# EAGLE design relay (EAGLE 9.6.2)
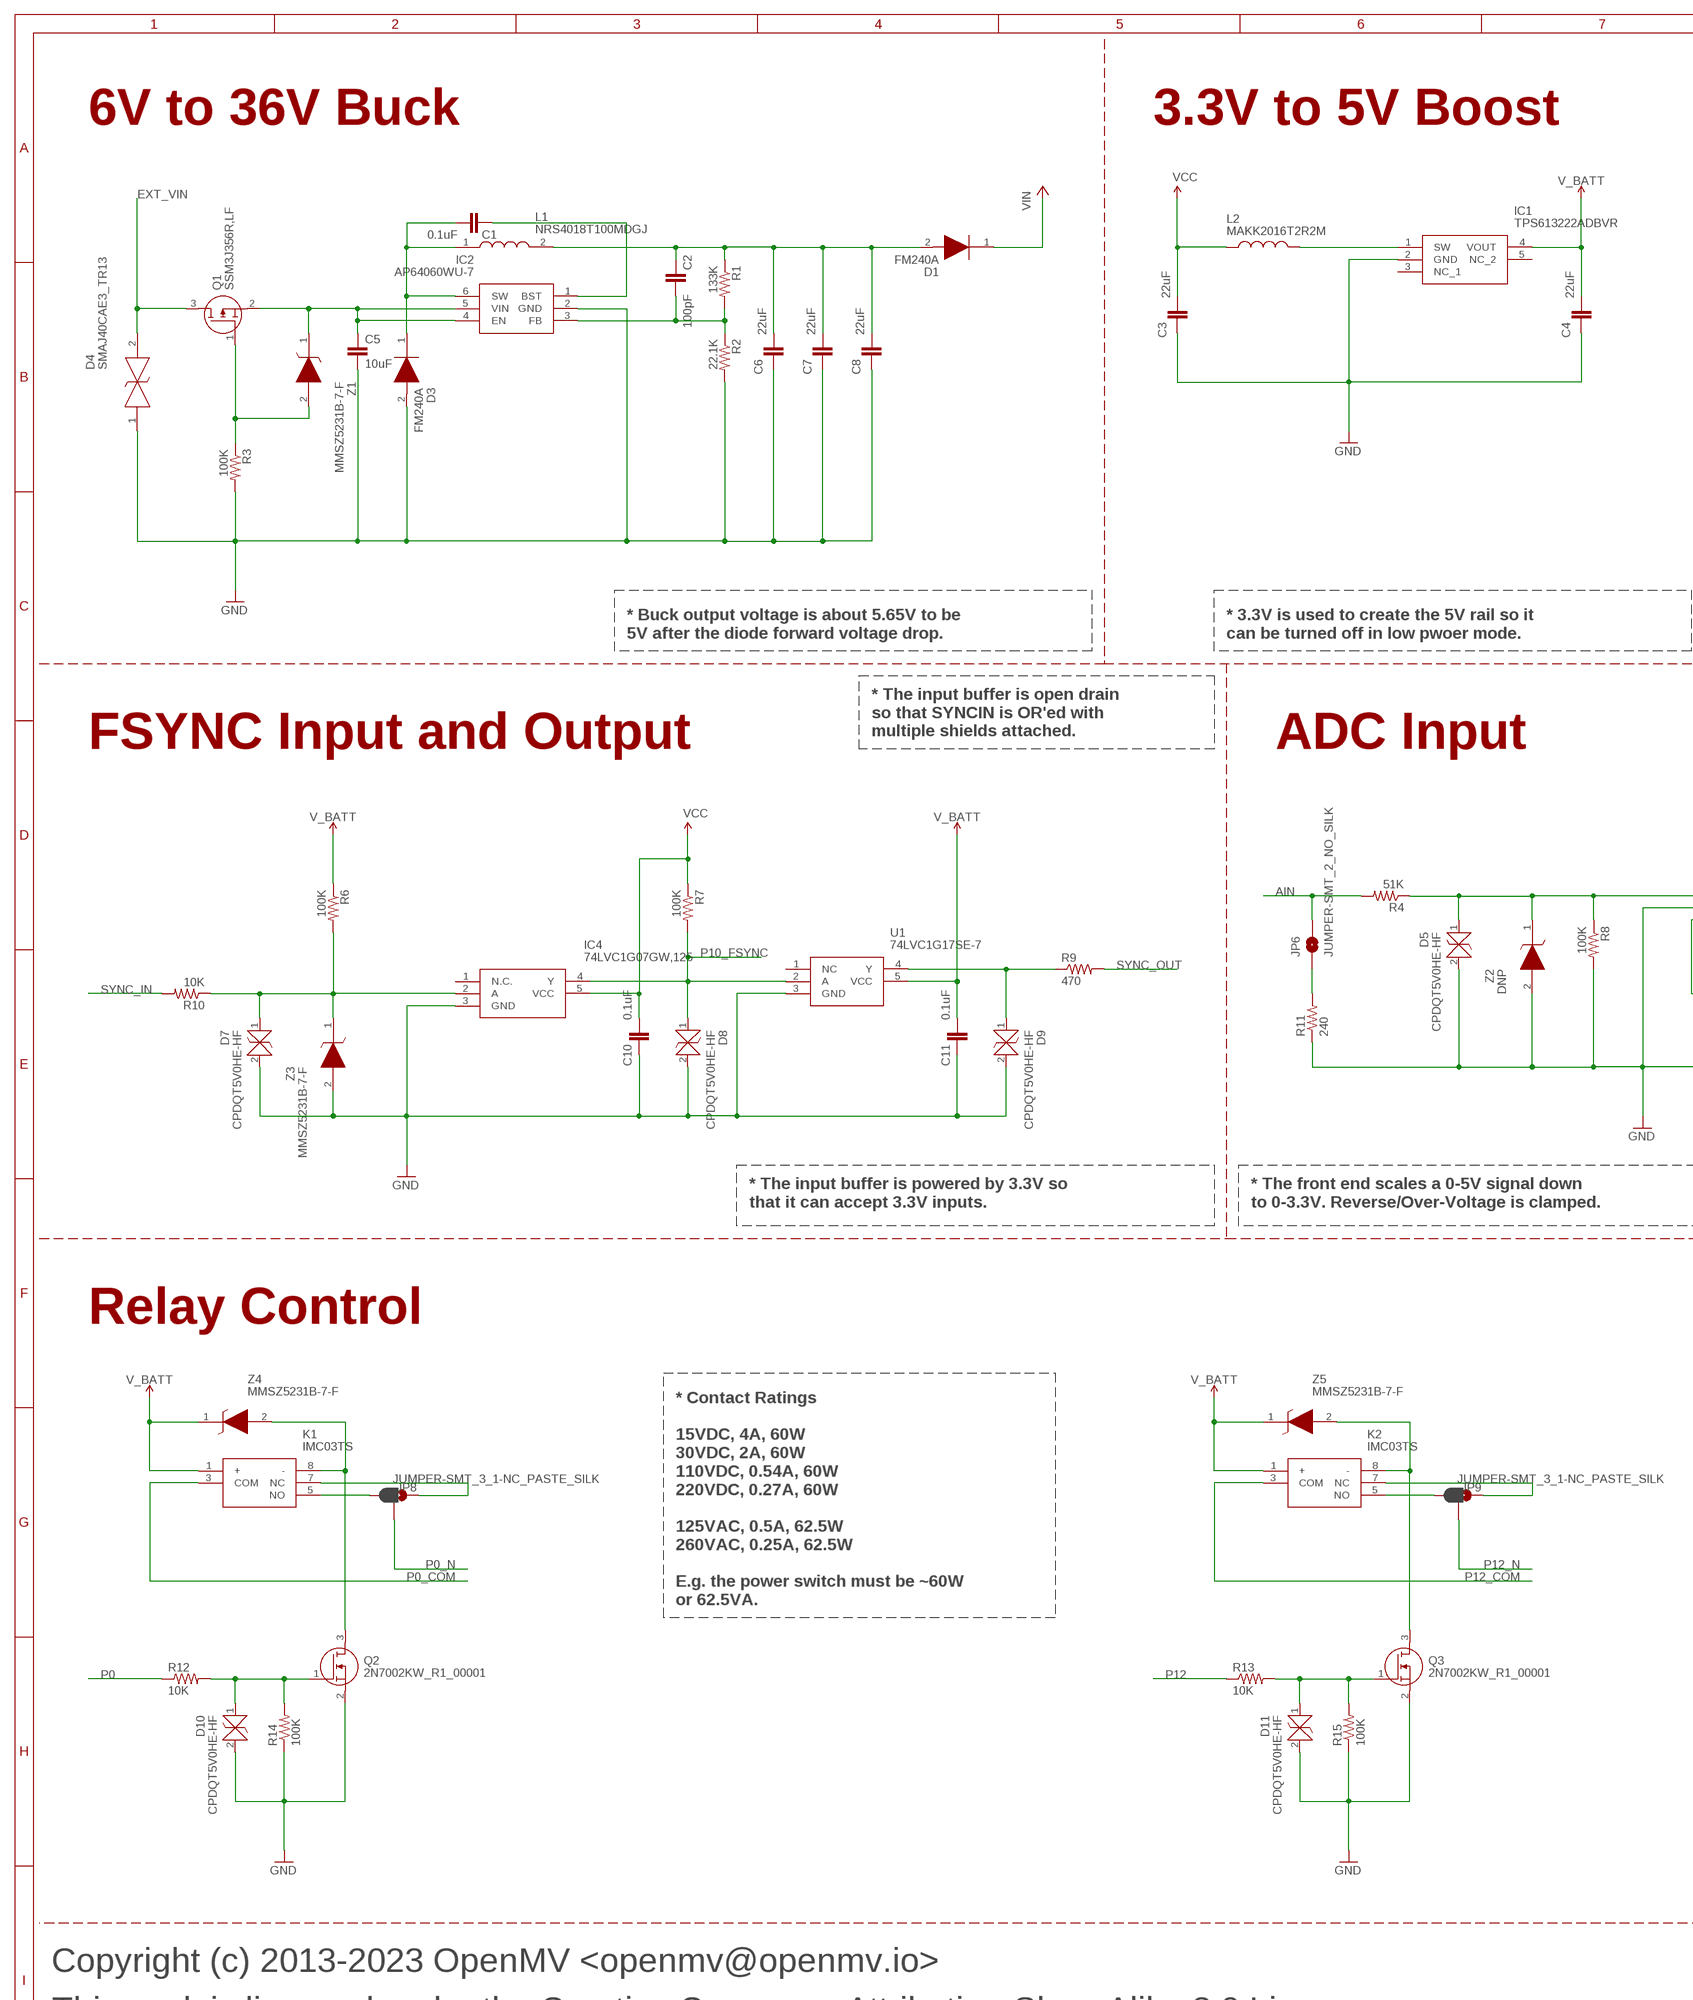
[diagram p0: schematic, sheet 1, part 1 of 2]
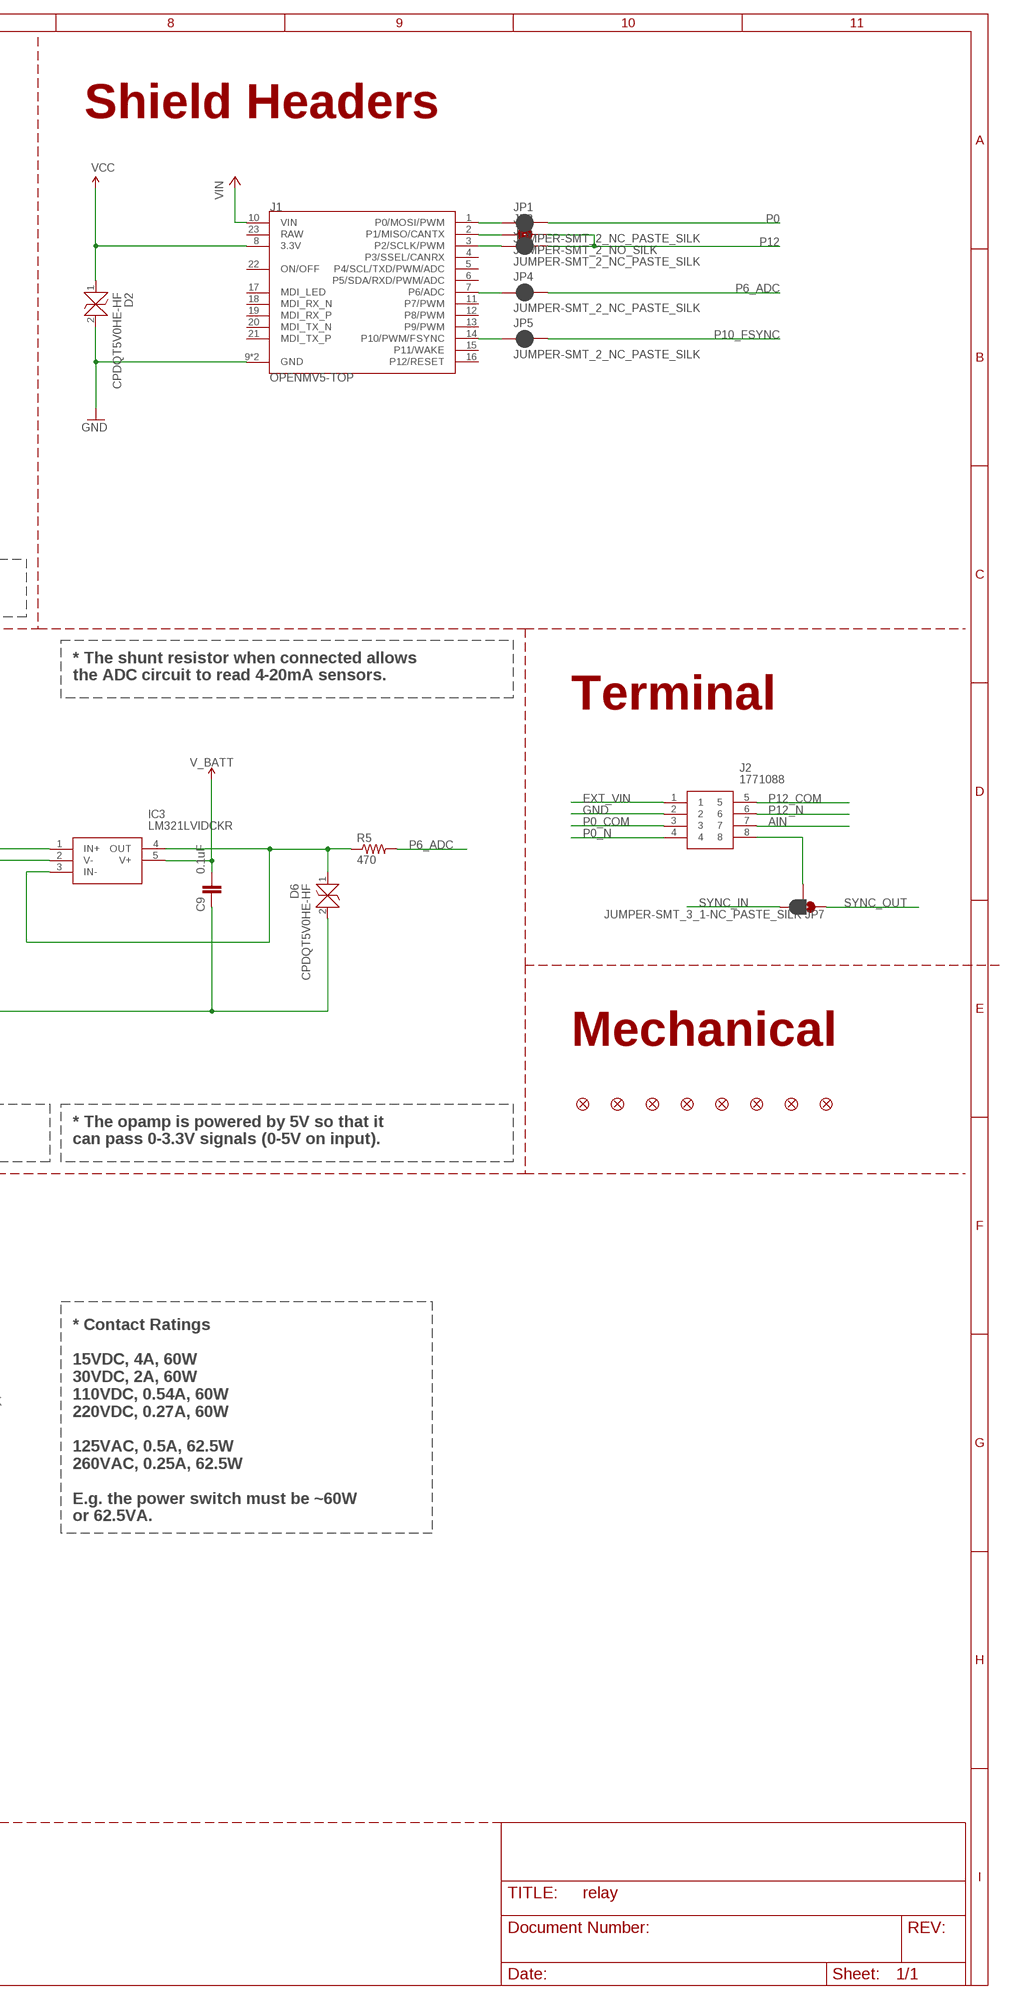
[diagram p1: schematic, sheet 1, part 2 of 2]

## Parts
C1  0.1uF  CAP0402-CAP  [0402-CAP]
C2  100pF  CAP0402-CAP  [0402-CAP]
C3  22uF  22UF-0805-6.3V-20%  [0805]
C4  22uF  22UF-0805-6.3V-20%  [0805]
C5  10uF  C-EUC0805  [C0805]
C6  22uF  22UF-0805-6.3V-20%  [0805]
C7  22uF  22UF-0805-6.3V-20%  [0805]
C8  22uF  22UF-0805-6.3V-20%  [0805]
C9  0.1uF  CAP0402-CAP  [0402-CAP]
C10  0.1uF  CAP0402-CAP  [0402-CAP]
C11  0.1uF  CAP0402-CAP  [0402-CAP]
D1  FM240A  [DIOM5025X231N]
D2  CPDQT5V0HE-HF  [CPDQT5V0HEHF]
D3  FM240A  [DIOM5025X231N]
D4  SMAJ40CAE3_TR13  [SMAJ40CAE3TR13]
D5  CPDQT5V0HE-HF  [CPDQT5V0HEHF]
D6  CPDQT5V0HE-HF  [CPDQT5V0HEHF]
D7  CPDQT5V0HE-HF  [CPDQT5V0HEHF]
D8  CPDQT5V0HE-HF  [CPDQT5V0HEHF]
D9  CPDQT5V0HE-HF  [CPDQT5V0HEHF]
D10  CPDQT5V0HE-HF  [CPDQT5V0HEHF]
D11  CPDQT5V0HE-HF  [CPDQT5V0HEHF]
FD1  FIDUCIAL1X2  [FIDUCIAL-1X2]
FD2  FIDUCIAL1X2  [FIDUCIAL-1X2]
FD3  FIDUCIAL1X2  [FIDUCIAL-1X2]
FD4  FIDUCIAL1X2  [FIDUCIAL-1X2]
FD5  FIDUCIAL1X2  [FIDUCIAL-1X2]
FD6  FIDUCIAL1X2  [FIDUCIAL-1X2]
FD7  FIDUCIAL1X2  [FIDUCIAL-1X2]
FD8  FIDUCIAL1X2  [FIDUCIAL-1X2]
IC1  TPS613222ADBVR  [SOT95P280X145-5N]
IC2  AP64060WU-7  [SOT95P280X100-6N]
IC3  LM321LVIDCKR  [SOT65P210X110-5N]
IC4  74LVC1G07GW,125  [SOT65P212X110-5N]
J1  OPENMV5-TOP  [OPENMV5-TOP]
J2  1771088  [1771088]
JP1  JUMPER-SMT_2_NC_PASTE_SILK  [SMT-JUMPER_2_NC_PASTE_SILK]
JP2  JUMPER-SMT_2_NO_SILK  [SMT-JUMPER_2_NO_SILK]
JP3  JUMPER-SMT_2_NC_PASTE_SILK  [SMT-JUMPER_2_NC_PASTE_SILK]
JP4  JUMPER-SMT_2_NC_PASTE_SILK  [SMT-JUMPER_2_NC_PASTE_SILK]
JP5  JUMPER-SMT_2_NC_PASTE_SILK  [SMT-JUMPER_2_NC_PASTE_SILK]
JP6  JUMPER-SMT_2_NO_SILK  [SMT-JUMPER_2_NO_SILK]
JP7  JUMPER-SMT_3_1-NC_PASTE_SILK  [SMT-JUMPER_3_1-NC_PASTE_SILK]
JP8  JUMPER-SMT_3_1-NC_PASTE_SILK  [SMT-JUMPER_3_1-NC_PASTE_SILK]
JP9  JUMPER-SMT_3_1-NC_PASTE_SILK  [SMT-JUMPER_3_1-NC_PASTE_SILK]
K1  IMC03TS  [IMC03TS]
K2  IMC03TS  [IMC03TS]
L1  NRS4018T100MDGJ  [NRS4018T100MDGJ]
L2  MAKK2016T2R2M  [INDC2016X100N]
Q1  SSM3J356R,LF  [SOTFL95P240X88-3N]
Q2  2N7002KW_R1_00001  [SOT65P210X110-3N]
Q3  2N7002KW_R1_00001  [SOT65P210X110-3N]
R1  133K  RESISTOR0402-RES  [0402-RES]
R2  22.1K  RESISTOR0402-RES  [0402-RES]
R3  100K  RESISTOR0402-RES  [0402-RES]
R4  51K  RESISTOR0402-RES  [0402-RES]
R5  470  R-US_R0603  [R0603]
R6  100K  RESISTOR0402-RES  [0402-RES]
R7  100K  RESISTOR0402-RES  [0402-RES]
R8  100K  RESISTOR0402-RES  [0402-RES]
R9  470  R-US_R0603  [R0603]
R10  10K  RESISTOR0402-RES  [0402-RES]
R11  240  R-US_R0603  [R0603]
R12  10K  RESISTOR0402-RES  [0402-RES]
R13  10K  RESISTOR0402-RES  [0402-RES]
R14  100K  RESISTOR0402-RES  [0402-RES]
R15  100K  RESISTOR0402-RES  [0402-RES]
U1  74LVC1G17SE-7  [SOT65P210X110-5N]
Z1  MMSZ5231B-7-F  [SOD3716X145N]
Z2  DNP  MM3Z3V6T1G  [SOD2512X110N]
Z3  MMSZ5231B-7-F  [SOD3716X145N]
Z4  MMSZ5231B-7-F  [SOD3716X145N]
Z5  MMSZ5231B-7-F  [SOD3716X145N]

## Nets
AIN [signal]: J2.7 JP6.2 R4.2
AIN_INT [signal]: D5.1 IC3.1(IN+) R4.1 R8.1 Z2.1(K)
AIN_OUT [signal]: D6.1 IC3.3(IN-) IC3.4(OUT) R5.1
AIN_S [signal]: JP6.1 R11.2
EXT_VIN [hipwr]: D4.2 J2.1 Q1.3(D)
EXT_VIN_BST [hipwr]: C1.1 IC2.1(BST)
EXT_VIN_FB [hipwr]: C2.2 IC2.3(FB) R1.2 R2.1
EXT_VIN_G [hipwr]: Q1.1(G) R3.1 Z1.2(A)
EXT_VIN_INT [hipwr]: C5.1 IC2.4(EN) IC2.5(VIN) Q1.2(S) Z1.1(K)
EXT_VIN_OUT [hipwr]: C2.1 C6.2 C7.2 C8.2 D1.2(A) L1.2 R1.1
EXT_VIN_SW [hipwr]: C1.2 D3.1(K) IC2.6(SW) L1.1
GND [gnd]: C3.1 C4.1 C5.2 C6.1 C7.1 C8.1 C9.1 C10.1 C11.1 D2.2 D3.2(A) D4.1 D5.2 D6.2 D7.2 D8.2 D9.2 D10.2 D11.2 IC1.2(GND) IC2.2(GND) IC3.2(V-) IC4.3(GND) J1.9(GND) J1.24(GND) J2.2 Q2.2(S) Q3.2(S) R2.2 R3.2 R8.2 R11.1 R14.1 R15.1 U1.3(GND) Z2.2(A) Z3.2(A)
P0 [signal]: JP1.2 R12.1
P0_COM [acpwr]: J2.3 K1.3(COM)
P0_CONTROL [signal]: D10.1 Q2.1(G) R12.2 R14.2
P0_INT [signal]: J1.1(P0/MOSI/PWM) JP1.1
P0_N [acpwr]: J2.4 JP8.2
P0_NC [acpwr]: JP8.1 K1.7(NC)
P0_NO [acpwr]: JP8.3 K1.5(NO)
P0_RELAY [signal]: K1.8(-) Q2.3(D) Z4.2(A)
P1_INT [signal]: J1.2(P1/MISO/CANTX) JP2.1
P2_INT [signal]: J1.3(P2/SCLK/PWM) JP3.1
P6_ADC [signal]: JP4.2 R5.2
P6_ADC_INT [signal]: J1.7(P6/ADC) JP4.1
P10_FSYNC [signal]: D8.1 IC4.4(Y) JP5.2 R7.2 U1.2(A)
P10_FSYNC_INT [signal]: J1.14(P10/PWM/FSYNC) JP5.1
P12 [signal]: JP2.2 JP3.2 R13.1
P12_COM [acpwr]: J2.5 K2.3(COM)
P12_CONTROL [signal]: D11.1 Q3.1(G) R13.2 R15.2
P12_N [acpwr]: J2.6 JP9.2
P12_NC [acpwr]: JP9.1 K2.7(NC)
P12_NO [acpwr]: JP9.3 K2.5(NO)
P12_RELAY [signal]: K2.8(-) Q3.3(D) Z5.2(A)
SW [pwr]: IC1.1(SW) L2.2
SYNC [signal]: J2.8 JP7.2
SYNC_IN [signal]: JP7.3 R10.2
SYNC_IN_INT [signal]: D7.1 IC4.2(A) R6.2 R10.1 Z3.1(K)
SYNC_OUT [signal]: JP7.1 R9.2
SYNC_OUT_INT [signal]: D9.1 R9.1 U1.4(Y)
V_BATT [pwr]: C4.2 C9.2 C11.2 IC1.4(VOUT) IC3.5(V+) K1.1(+) K2.1(+) R6.1 U1.5(VCC) Z4.1(K) Z5.1(K)
VCC [pwr]: C3.2 C10.2 D2.1 IC4.5(VCC) J1.8(3.3V) L2.1 R7.1
VIN [hipwr]: D1.1(K) J1.10(VIN)
Unconnected: IC1.3(NC_1) IC1.5(NC_2) IC4.1(N.C.) J1.4(P3/SSEL/CANRX) J1.5(P4/SCL/TXD/PWM/ADC) J1.6(P5/SDA/RXD/PWM/ADC) J1.11(P7/PWM) J1.12(P8/PWM) J1.13(P9/PWM) J1.15(P11/WAKE) J1.16(P12/RESET) J1.17(MDI_LED) J1.18(MDI_RX_N) J1.19(MDI_RX_P) J1.20(MDI_TX_N) J1.21(MDI_TX_P) J1.22(ON/OFF) J1.23(RAW) U1.1(NC)

## Notes on the sheet
- 6V to 36V Buck | 3.3V to 5V Boost | Shield Headers
- * Buck output voltage is about 5.65V to be
  5V after the diode forward voltage drop.
- * 3.3V is used to create the 5V rail so it
  can be turned off in low pwoer mode.
- * The shunt resistor when connected allows
  the ADC circuit to read 4-20mA sensors.
- * The input buffer is open drain
  so that SYNCIN is OR'ed with
  multiple shields attached.
- FSYNC Input and Output | ADC Input | Terminal
- Mechanical
- * The input buffer is powered by 3.3V so
  that it can accept 3.3V inputs.
- * The front end scales a 0-5V signal down
  to 0-3.3V. Reverse/Over-Voltage is clamped.
- * The opamp is powered by 5V so that it
  can pass 0-3.3V signals (0-5V on input).
- Relay Control
- * Contact Ratings
  
  15VDC, 4A, 60W
  30VDC, 2A, 60W
  110VDC, 0.54A, 60W
  220VDC, 0.27A, 60W
  
  125VAC, 0.5A, 62.5W
  260VAC, 0.25A, 62.5W
  
  E.g. the power switch must be ~60W
  or 62.5VA.
- * Contact Ratings
  
  15VDC, 4A, 60W
  30VDC, 2A, 60W
  110VDC, 0.54A, 60W
  220VDC, 0.27A, 60W
  
  125VAC, 0.5A, 62.5W
  260VAC, 0.25A, 62.5W
  
  E.g. the power switch must be ~60W
  or 62.5VA.
- Copyright (c) 2013-2023 OpenMV <openmv@openmv.io>
- This work is licensed under the Creative Commons Attribution-ShareAlike 3.0 License.
- To view a copy of this license, visit http://creativecommons.org/licenses/by-sa/3.0/

## Library data of the parts
C1 C9-C11 = sfe:CAP: Capacitor Standard 0603 ceramic capacitor, and 0.1" leaded capacitor.; MPN: GRM155R71H104KE14D
C2 = sfe:CAP: Capacitor Standard 0603 ceramic capacitor, and 0.1" leaded capacitor.; MPN: CC0402JRNPO9BN101
C3 C4 C6-C8 = SparkFun-Capacitors:22UF: 22µF ceramic capacitors A capacitor is a passive two-terminal electrical component used to store electrical energy temporarily in an electric field.; MPN: CL21A226MQQNNNE; PROD_ID: CAP-08402
C5 = rcl:C-EU: CAPACITOR, European symbol; MPN: GRM21BR61H106KE43K; SPICEPREFIX: C
D1 D3 = FM240A:FM240A: Diodes - General Purpose, Power, Switching GP Si Rectifier SMB,2A,40V Source: Datasheet <https://ms.componentsearchengine.com/Datasheets/1/FM240A.pdf>; DESCRIPTION: Diodes - General Purpose, Power, Switching GP Si Rectifier SMB,2A,40V; HEIGHT: 2.31mm; MANUFACTURER_NAME: Rectron; MANUFACTURER_PART_NUMBER: FM240A; MOUSER_PART_NUMBER: 583-FM240A; MOUSER_PRICE-STOCK: https://www.mouser.co.uk/ProductDetail/Rectron/FM240A?qs=7pEAo90IqNG7sknZwmLYhQ%3D%3D; MPN: FM240A
D2 D5-D11 = CPDQT5V0HE-HF:CPDQT5V0HE-HF: ESD Suppressors / TVS Diodes DIODE ESD 5VWM 65W 0402/SOD-923F Source: Datasheet <https://www.comchiptech.com/admin/files/product/CPDQT5V0HE-HF RevA.PDF>; DESCRIPTION: ESD Suppressors / TVS Diodes DIODE ESD 5VWM 65W 0402/SOD-923F; HEIGHT: 0.42mm; MANUFACTURER_NAME: Comchip Technology; MANUFACTURER_PART_NUMBER: CPDQT5V0HE-HF; MPN: CPDQT5V0HE-HF
D4 = SMAJ40CAe3_TR13:SMAJ40CAE3_TR13: ESD Suppressors / TVS Diodes TVS Source: Datasheet <https://www.arrow.com/en/products/smaj40cae3tr13/microchip-technology?region=nac>; DESCRIPTION: ESD Suppressors / TVS Diodes TVS; HEIGHT: 3.05mm; MANUFACTURER_NAME: Microchip; MANUFACTURER_PART_NUMBER: SMAJ40CAe3/TR13; MOUSER_PART_NUMBER: 494-SMAJ40CAE3/TR13; MOUSER_PRICE-STOCK: https://www.mouser.co.uk/ProductDetail/Microchip-Technology/SMAJ40CAe3-TR13?qs=pU29NIZ4ZwCw3PnlxOleOw%3D%3D; MPN: SMAJ40CAe3/TR13
FD1-FD8 = SparkFun-Aesthetics:FIDUCIAL: Fiducial Alignment Points Point-of-reference for pick-and-place machines and other optical instruments.
IC1 = TPS613222ADBVR:TPS613222ADBVR: 6-uA Quiescent Current, 1.8-A Switch Current Boost Converter Source: Datasheet <http://www.ti.com/lit/gpn/tps61322>; DESCRIPTION: 6-uA Quiescent Current, 1.8-A Switch Current Boost Converter; HEIGHT: 1.45mm; MANUFACTURER_NAME: Texas Instruments; MANUFACTURER_PART_NUMBER: TPS613222ADBVR; MOUSER_PART_NUMBER: 595-TPS613222ADBVR; MOUSER_PRICE-STOCK: https://www.mouser.co.uk/ProductDetail/Texas-Instruments/TPS613222ADBVR?qs=W0yvOO0ixfE4d69WXsn8NQ%3D%3D; MPN: TPS613222ADBVR
IC2 = AP64060WU-7:AP64060WU-7: Switching Voltage Regulators DCDC Conv HV Buck TSOT26(STD) T&R 3K Source: Datasheet <https://www.diodes.com/assets/Datasheets/AP64060.pdf>; DESCRIPTION: Switching Voltage Regulators DCDC Conv HV Buck TSOT26(STD) T&R 3K; HEIGHT: 1mm; MANUFACTURER_NAME: Diodes Inc.; MANUFACTURER_PART_NUMBER: AP64060WU-7; MOUSER_PART_NUMBER: 621-AP64060WU-7; MOUSER_PRICE-STOCK: https://www.mouser.co.uk/ProductDetail/Diodes-Incorporated/AP64060WU-7?qs=Li%252BoUPsLEntiZYjFw%252BCbiQ%3D%3D; MPN: AP64060WU-7
IC3 = LM321LVIDCKR:LM321LVIDCKR: 1-Channel industry standard low voltage operational amplifier Source: Datasheet <http://www.ti.com/lit/gpn/LM321LV>; DESCRIPTION: 1-Channel industry standard low voltage operational amplifier; HEIGHT: 1.1mm; MANUFACTURER_NAME: Texas Instruments; MANUFACTURER_PART_NUMBER: LM321LVIDCKR; MOUSER_PART_NUMBER: 595-LM321LVIDCKR; MOUSER_PRICE-STOCK: https://www.mouser.co.uk/ProductDetail/Texas-Instruments/LM321LVIDCKR?qs=qSfuJ%252Bfl%2Fd6RcyTOjkRx5Q%3D%3D; MPN: LM321LVIDCKR
IC4 = 74LVC1G07GW_125:74LVC1G07GW,125: 74LVC1G07 - Buffer with open-drain output@en-us Source: Datasheet <https://assets.nexperia.com/documents/data-sheet/74LVC1G07.pdf>; DESCRIPTION: 74LVC1G07 - Buffer with open-drain output@en-us; HEIGHT: 1.1mm; MANUFACTURER_NAME: Nexperia; MANUFACTURER_PART_NUMBER: 74LVC1G07GW,125; MOUSER_PART_NUMBER: 771-74LVC1G07GW-G; MOUSER_PRICE-STOCK: https://www.mouser.co.uk/ProductDetail/Nexperia/74LVC1G07GW125?qs=me8TqzrmIYW763Mg%2FG86Uw%3D%3D; MPN: 74LVC1G07GW,125
J1 = openmv5:OPENMV5-TOP
J2 = 1771088:1771088: PCB terminal block, nominal current: 6 A, rated voltage (III/2): 160 V, nominal cross section: 0.5 mm?, Number of potentials: 8, Number of rows: 1, Number of positions per row: 8, product range: PTSM 0,5/..-H-SMD, pitch: 2.5 mm, connection method: Push-in spring connection, mounting: SMD soldering, conductor/PCB connection direction: 0 ?, color: black, Pin layout: Linear pad geometry, type of packaging: packed in cardboard Source: Datasheet <http://www.phoenixcontact.net/product/1771088>; DESCRIPTION: PCB terminal block, nominal current: 6 A, rated voltage (III/2): 160 V, nominal cross section: 0.5 mm?, Number of potentials: 8, Number of rows: 1, Number of positions per row: 8, product range: PTSM 0,5/..-H-SMD, pitch: 2.5 mm, connection method: Push-in spring connection, mounting: SMD soldering, conductor/PCB connection direction: 0 ?, color: black, Pin layout: Linear pad geometry, type of packaging: packed in cardboard; HEIGHT: 5.22mm; MANUFACTURER_NAME: Phoenix Contact; MANUFACTURER_PART_NUMBER: 1771088; MOUSER_PART_NUMBER: 651-1771088; MOUSER_PRICE-STOCK: https://www.mouser.co.uk/ProductDetail/Phoenix-Contact/1771088?qs=Q77YN%2FRrsKIDMojcNKtpFQ%3D%3D; MPN: 1771088
JP1 JP3-JP5 = SparkFun-Jumpers:JUMPER-SMT_2_NC_PASTE: Normally closed solder jumper This jumper has an aperture in the stencil to allow solder paste to bridge the split in the wire so it's normally closed (NC). Wick off the solder to open the connection. Reapply solder to reclose the connection.
JP2 JP6 = SparkFun-Jumpers:JUMPER-SMT_2_NO: Normally open jumper This jumper has two pads in close proximity to each other. Apply solder to close the connection. Round pads are easier to solder for beginners, but are a lot larger. SparkFun Product that uses the round pads: SparkFun EL Sequencer <https://www.sparkfun.com/products/12781>
JP7-JP9 = SparkFun-Jumpers:JUMPER-SMT_3_1-NC_PASTE: Normally closed solder jumper (1 of 2 connections) This jumper has an aperture in the stencil to allow solder paste to bridge one of the two connections. One connection is normally closed (NC), while the other is normally open (NO). Wick off the solder to open the connection. Reapply solder to reclose the connection. Apply solder to the other side instead to change the current path.
K1 K2 = IMC03TS:IMC03TS: TE CONNECTIVITY - IMC03TS - RELAY, SIGNAL, SPDT, 30VDC, 2A Source: Datasheet <https://componentsearchengine.com/Datasheets/1/IMC03TS.pdf>; DESCRIPTION: TE CONNECTIVITY - IMC03TS - RELAY, SIGNAL, SPDT, 30VDC, 2A; HEIGHT: 5mm; MANUFACTURER_NAME: TE Connectivity; MANUFACTURER_PART_NUMBER: IMC03TS; MOUSER_PART_NUMBER: 655-IMC03TS; MOUSER_PRICE-STOCK: https://www.mouser.co.uk/ProductDetail/TE-Connectivity/IMC03TS?qs=cjQ5B1jJSzR1ZiTl5Tzf3w%3D%3D; MPN: IMC03CTS
L1 = NRS4018T100MDGJ:NRS4018T100MDGJ: Fixed Inductors 4018 10uH 180mOhms +/-20%Tol 1200mA Source: Datasheet <https://datasheet.datasheetarchive.com/originals/distributors/Datasheets-DGA11/2190952.pdf>; DESCRIPTION: Fixed Inductors 4018 10uH 180mOhms +/-20%Tol 1200mA; HEIGHT: 1mm; MANUFACTURER_NAME: TAIYO YUDEN; MANUFACTURER_PART_NUMBER: NRS4018T100MDGJ; MOUSER_PART_NUMBER: 963-NRS4018T100MDGJ; MOUSER_PRICE-STOCK: https://www.mouser.co.uk/ProductDetail/TAIYO-YUDEN/NRS4018T100MDGJ?qs=PzICbMaShUeiyHfvjt6KEw%3D%3D; MPN: NRS4018T100MDGJ
L2 = MAKK2016T2R2M:MAKK2016T2R2M: INDUCTOR, METAL CORE Check availability <https://pricing.snapeda.com/parts/MAKK2016T2R2M/Taiyo%20Yuden/view-part?ref=eda>; AVAILABILITY: In Stock; DESCRIPTION: 2.2 µH Shielded Drum Core, Wirewound Inductor 1.5 A 160mOhm Max 0806 (2016 Metric); MF: Taiyo Yuden; MP: MAKK2016T2R2M; MPN: MAKK2016T2R2M; PACKAGE: 2016 Taiyo Yuden; PRICE: None; PURCHASE-URL: https://pricing.snapeda.com/search/part/MAKK2016T2R2M/?ref=eda
Q1 = SSM3J356R_LF:SSM3J356R,LF: MOSFET Small-signal MOSFET ID: -2A, VDSS: -60V Source: Datasheet <http://toshiba.semicon-storage.com/info/docget.jsp?did=30685&prodName=SSM3J356R>; DESCRIPTION: MOSFET Small-signal MOSFET ID: -2A, VDSS: -60V; HEIGHT: 0.88mm; MANUFACTURER_NAME: Toshiba; MANUFACTURER_PART_NUMBER: SSM3J356R,LF; MOUSER_PART_NUMBER: 757-SSM3J356RLF; MOUSER_PRICE-STOCK: https://www.mouser.co.uk/ProductDetail/Toshiba/SSM3J356RLF?qs=lhkzy8lC%252BSsL%2F1yLGjMnQA%3D%3D; MPN: SSM3J356R,LF
Q2 Q3 = 2N7002KW_R1_00001:2N7002KW_R1_00001: MOSFET 60V N-Channel Enhancement Mode MOSFET - ESD Protected Source: Datasheet <https://www.panjit.com.tw/upload/datasheet/2N7002KW.pdf>; DESCRIPTION: MOSFET 60V N-Channel Enhancement Mode MOSFET - ESD Protected; HEIGHT: 1.1mm; MANUFACTURER_NAME: PANJIT; MANUFACTURER_PART_NUMBER: 2N7002KW_R1_00001; MOUSER_PART_NUMBER: 241-2N7002KWR100001; MOUSER_PRICE-STOCK: https://www.mouser.co.uk/ProductDetail/Panjit/2N7002KW_R1_00001?qs=sPbYRqrBIVliWKATqv7jNA%3D%3D; MPN: 2N7002KW_R1_00001
R1 = sfe:RESISTOR: Resistor Basic schematic elements and footprints for 0603, 1206, and PTH resistors.; MPN: RC0402FR-07133KL
R2 = sfe:RESISTOR: Resistor Basic schematic elements and footprints for 0603, 1206, and PTH resistors.; MPN: CR0402-FX-2212GLF
R3 R6-R8 R14 R15 = sfe:RESISTOR: Resistor Basic schematic elements and footprints for 0603, 1206, and PTH resistors.; MPN: AC0402FR-07100KL
R4 = sfe:RESISTOR: Resistor Basic schematic elements and footprints for 0603, 1206, and PTH resistors.; MPN: RC0402JR-0751KL
R5 R9 = rcl:R-US_: RESISTOR, American symbol; MPN: CR0603-FX-4700ELF; SPICEPREFIX: R
R10 R12 R13 = sfe:RESISTOR: Resistor Basic schematic elements and footprints for 0603, 1206, and PTH resistors.; MPN: AC0402FR-1310KL
R11 = rcl:R-US_: RESISTOR, American symbol; MPN: RK73B1JTTD241J; SPICEPREFIX: R
U1 = 74LVC1G17SE-7:74LVC1G17SE-7: DiodesZetex 74LVC1G17SE-7, Buffer, Push-Pull, Non-Inverting, 1.65 5.5 V, 5-Pin SOT-353 Source: Datasheet <https://componentsearchengine.com/Datasheets/2/74LVC1G17SE-7.pdf>; DESCRIPTION: DiodesZetex 74LVC1G17SE-7, Buffer, Push-Pull, Non-Inverting, 1.65 5.5 V, 5-Pin SOT-353; HEIGHT: 1.1mm; MANUFACTURER_NAME: Diodes Inc.; MANUFACTURER_PART_NUMBER: 74LVC1G17SE-7; MOUSER_PART_NUMBER: 621-74LVC1G17SE-7; MOUSER_PRICE-STOCK: https://www.mouser.co.uk/ProductDetail/Diodes-Incorporated/74LVC1G17SE-7?qs=FRHfhEBFk1dzIcstjqNcyA%3D%3D; MPN: 74LVC1G17SE-7
Z1 Z3-Z5 = MMSZ5231B-7-F:MMSZ5231B-7-F: Zener Diode 5.1V 5% 500mW SOD123 Diodes Inc MMSZ5231B-7-F Zener Diode, 5.1V 5% 0.5 W SMT 2-Pin SOD-123 Source: Datasheet <https://www.diodes.com/assets/Datasheets/ds18010.pdf>; DESCRIPTION: Zener Diode 5.1V 5% 500mW SOD123 Diodes Inc MMSZ5231B-7-F Zener Diode, 5.1V 5% 0.5 W SMT 2-Pin SOD-123; HEIGHT: 1.45mm; MANUFACTURER_NAME: Diodes Inc.; MANUFACTURER_PART_NUMBER: MMSZ5231B-7-F; MOUSER_PART_NUMBER: 621-MMSZ5231B-F; MOUSER_PRICE-STOCK: https://www.mouser.co.uk/ProductDetail/Diodes-Incorporated/MMSZ5231B-7-F?qs=2ygBApjwyeMh7Sf0YL1qSw%3D%3D; MPN: MMSZ5231B-7-F
Z2 = MM3Z3V6T1G:MM3Z3V6T1G: ON Semiconductor MM3Z3V6T1G Zener Diode, 3.6V 5% 200 mW SMT 2-Pin SOD-323 Source: Datasheet <http://www.onsemi.com/pub/Collateral/MM3Z2V4T1-D.PDF>; DESCRIPTION: ON Semiconductor MM3Z3V6T1G Zener Diode, 3.6V 5% 200 mW SMT 2-Pin SOD-323; HEIGHT: 1.1mm; MANUFACTURER_NAME: onsemi; MANUFACTURER_PART_NUMBER: MM3Z3V6T1G; MOUSER_PART_NUMBER: 863-MM3Z3V6T1G; MOUSER_PRICE-STOCK: https://www.mouser.co.uk/ProductDetail/onsemi/MM3Z3V6T1G?qs=HVbQlW5zcXWbZo78nv8gqg%3D%3D; MPN: MM3Z3V6T1G; POPULATE: 0

## Net classes
0 default: width 0.127 mm, drill 0.254 mm, clearance 0.127 mm
2 gnd: width 0.127 mm, drill 0.254 mm, clearance 0.127 mm to class 0, clearance 0.127 mm to class 1, clearance 0.127 mm
3 pwr: width 0.127 mm, drill 0.254 mm, clearance 0.127 mm to class 0, clearance 0.127 mm to class 1, clearance 0.127 mm to class 2, clearance 0.127 mm
4 signal: width 0.127 mm, drill 0.254 mm, clearance 0.127 mm to class 0, clearance 0.127 mm to class 1, clearance 0.127 mm to class 2, clearance 0.127 mm to class 3, clearance 0.127 mm
5 acpwr: width 0.508 mm, drill 0.254 mm, clearance 1.016 mm to class 0, clearance 1.016 mm to class 1, clearance 1.016 mm to class 2, clearance 1.016 mm to class 3, clearance 1.016 mm to class 4, clearance 0.127 mm
6 hipwr: width 0.254 mm, drill 0.254 mm, clearance 0.254 mm to class 0, clearance 0.254 mm to class 1, clearance 0.254 mm to class 2, clearance 0.254 mm to class 3, clearance 0.254 mm to class 4, clearance 0.254 mm to class 5, clearance 0.254 mm

## Board
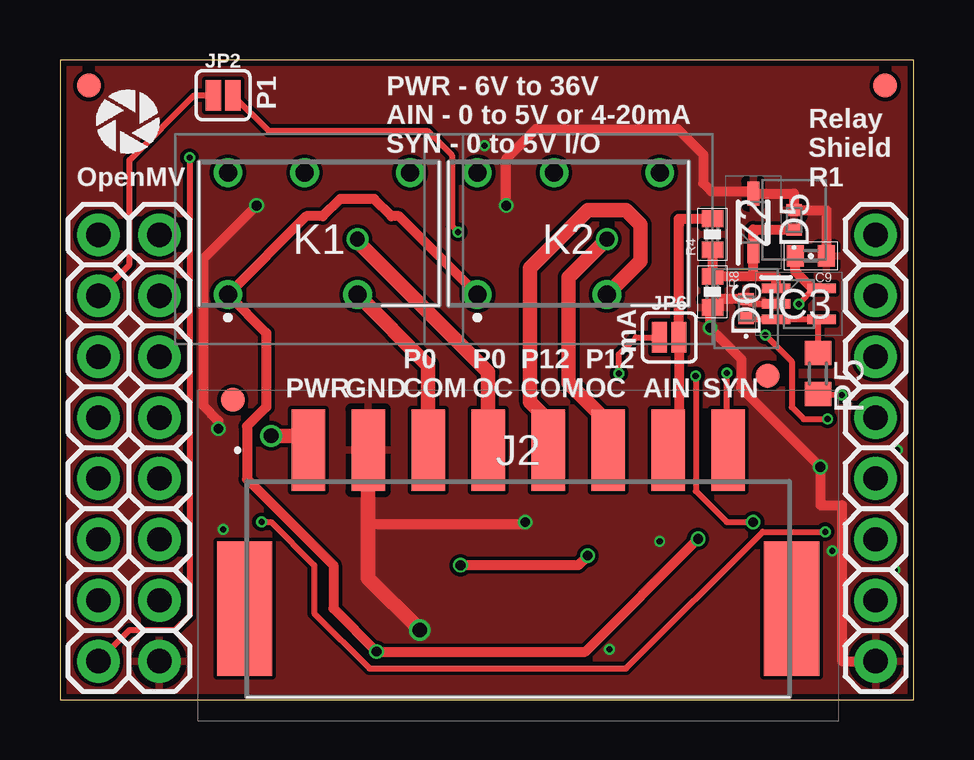
[diagram p2: board, top side]
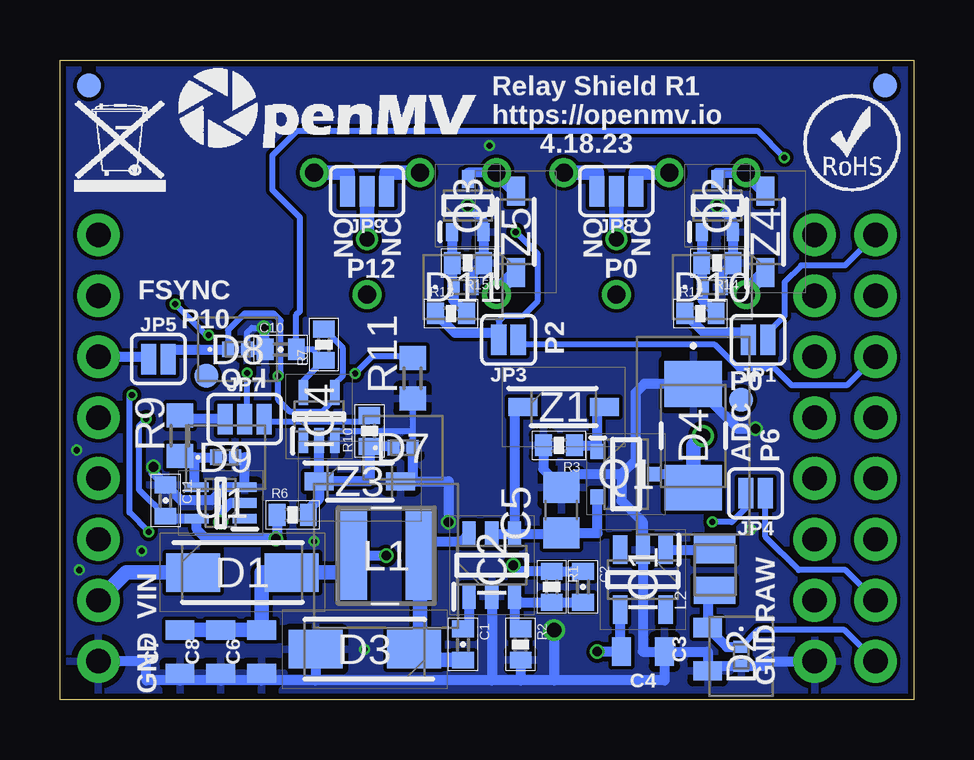
[diagram p3: board, bottom side, seen from below]

Size 35.6 x 26.67 mm. Coordinates in mm from the lower left corner, seen from the top.
Outline: 0,0 35.6,0 35.6,26.67 0,26.67 0,0
Copper layers (1*16): Top 0.035mm / dielectric 1.5mm / Bottom 0.035mm
Design rules "MF_Standard_2_Layer *": minimum track width 5mil, minimum drill 10mil, track to track 5mil, track to pad 5mil, pad to pad 5mil, via to via 5mil, smd to smd 0mil, copper to edge 10mil, drill to drill 10mil, minimum pad ring 4mil, minimum via ring 4mil, stop-mask expansion 2mil, vias tented up to drill 25mil, thermal gap 10mil

### Footprints (pad centres in the part's own frame; a part is rotated, then mirrored left to right if it is on the bottom)
0402-CAP = smd 0.7 x 0.9: 1 -0.65,0; 2 0.65,0
0805 = smd 0.8 x 1.2: 1 -0.9,0; 2 0.9,0
C0805 = smd 1.3 x 1.5: 1 -0.95,0; 2 0.95,0
DIOM5025X231N = smd 2.25 x 1.6: 1 -2.05,0; 2 2.05,0
CPDQT5V0HEHF = smd 0.5 x 0.65: 1 -0.4,0; 2 0.4,0
SMAJ40CAE3TR13 = smd 1.9 x 2.39: 1 -2.16,0; 2 2.16,0
FIDUCIAL-1X2 = smd 1 x 1: 1 0,0
SOT95P280X145-5N = smd 1.2 x 0.6: 1 -1.25,0.95; 2 -1.25,0; 3 -1.25,-0.95; 4 1.25,-0.95; 5 1.25,0.95
SOT95P280X100-6N = smd 1.05 x 0.55: 1 -1.3,0.95; 2 -1.3,0; 3 -1.3,-0.95; 4 1.3,-0.95; 5 1.3,0; 6 1.3,0.95
SOT65P210X110-5N = smd 1.2 x 0.4: 1 -0.95,0.65; 2 -0.95,0; 3 -0.95,-0.65; 4 0.95,-0.65; 5 0.95,0.65
SOT65P212X110-5N = smd 1.05 x 0.4: 1 -1,0.65; 2 -1,0; 3 -1,-0.65; 4 1,-0.65; 5 1,0.65
OPENMV5-TOP = drill 1.016 pad 1.778: 1 1.6,19.38; 2 1.6,16.84; 3 1.6,14.3; 4 1.6,11.76; 5 1.6,9.22; 6 1.6,6.68; 7 1.6,4.14; 8 1.6,1.6; 9 34,1.6; 10 34,4.14; 11 34,6.68; 12 34,9.22; 13 34,11.76; 14 34,14.3; 15 34,16.84; 16 34,19.38; 17 4.14,19.38; 18 4.14,16.84; 19 4.14,14.3; 20 4.14,11.76; 21 4.14,9.22; 22 4.14,6.68; 23 4.14,4.14; 24 4.14,1.6
1771088 = smd 1.4 x 3.4: 1 -8.75,0; 2 -6.25,0; 3 -3.75,0; 4 -1.25,0; 5 1.25,0; 6 3.75,0; 7 6.25,0; 8 8.75,0 | smd 2.3 x 5.6: 9 -11.4,-6.6; 10 11.4,-6.6
SMT-JUMPER_2_NC_PASTE_SILK = smd 0.635 x 1.27: 1 -0.406,0; 2 0.406,0
SMT-JUMPER_2_NO_SILK = smd 0.635 x 1.27: 1 -0.406,0; 2 0.406,0
SMT-JUMPER_3_1-NC_PASTE_SILK = smd 0.635 x 1.27: 1 -0.813,0; 2 0,0; 3 0.813,0
IMC03TS = drill 0.75 pad 1.2: 1 -3.8,-2.31; 3 1.6,-2.31; 5 3.8,2.77; 7 -0.6,2.77; 8 -3.8,2.77
NRS4018T100MDGJ = smd 1.2 x 3.7: 1 -1.4,0; 2 1.4,0
INDC2016X100N = smd 1.14 x 1.73: 1 -0.847,0; 2 0.847,0
SOTFL95P240X88-3N = smd 0.575 x 0.62: 1 -1.188,0.95; 2 -1.188,-0.95; 3 1.188,0
SOT65P210X110-3N = smd 0.75 x 0.5: 1 -1.1,0.65; 2 -1.1,-0.65; 3 1.1,0
0402-RES = smd 0.7 x 0.9: 1 -0.65,0; 2 0.65,0
R0603 = smd 1 x 1.1: 1 -0.85,0; 2 0.85,0
SOT65P210X110-5N' = smd 1 x 0.4: 1 -1,0.65; 2 -1,0; 3 -1,-0.65; 4 1,-0.65; 5 1,0.65
SOD3716X145N = smd 1.2 x 0.75: 1 -1.7,0; 2 1.7,0
SOD2512X110N = smd 1 x 0.5: 1 -1.2,0; 2 1.2,0

### Placement (x,y rotation side)
C1  18.8,2.3 270 bottom
C2  13.8,4.7 270 bottom
C3  8.6,2.1 90 bottom
C4  11.3,2 180 bottom
C5  14.7,7.9 90 bottom
C6  27.2,2 90 bottom
C7  30.6,2 90 bottom
C8  28.9,2 90 bottom
C9  31.3,18.5 180 top
C10  26.4,14.6 0 bottom
C11  31.2,8.3 270 bottom
D1  28,5.3 0 bottom
D2  7.2,1.8 270 bottom
D3  22.9,2.1 180 bottom
D4  9.2,11 270 bottom
D5  30.6,20 90 top
D6  28.6,16.3 90 top
D7  21.3,10.5 0 bottom
D8  28.2,14.6 0 bottom
D9  28.7,10.1 0 bottom
D10  8.4,17.2 0 bottom
D11  18.8,17.2 0 bottom
FD1  29.5,13.5 0 top
FD2  29.5,13.5 0 bottom
FD3  7.2,12.5 0 top
FD4  7.2,12.5 0 bottom
FD5  34.4,25.6 0 top
FD6  34.4,25.6 0 bottom
FD7  1.2,25.6 0 top
FD8  1.2,25.6 0 bottom
IC1  11.3,5 270 bottom
IC2  17.6,5.6 90 bottom
IC3  30.8,16.5 0 top
IC4  24.8,11.8 90 bottom
J1  0,0 0 top
J2  19.1,10.4 0 top
JP1  6.5,15 180 bottom
JP2  6.8,25.2 0 top
JP3  16.9,15 180 bottom
JP4  6.6,8.6 180 bottom
JP5  31.5,14.2 0 bottom
JP6  25.4,15.1 0 top
JP7  27.9,11.7 0 bottom
JP8  12.4,21.2 180 bottom
JP9  22.8,21.2 180 bottom
K1  10.8,19.2 0 top
K2  21.2,19.2 0 top
L1  22,6 180 bottom
L2  8.3,5.4 90 bottom
Q1  12,9.4 0 bottom
Q2  8.2,20.6 90 bottom
Q3  18.6,20.6 90 bottom
R1  15.1,4.7 270 bottom
R2  16.4,2.3 270 bottom
R3  14.8,10.6 180 bottom
R4  27.2,19.4 90 top
R5  31.6,13.6 270 top
R6  25.9,7.7 0 bottom
R7  24.6,14.8 90 bottom
R8  27.2,17 270 top
R9  30.6,11 90 bottom
R10  22.7,11.2 90 bottom
R11  20.9,13.4 90 bottom
R12  8.9,16.1 0 bottom
R13  19.3,16.1 0 bottom
R14  8.2,18.2 180 bottom
R15  18.6,18.2 180 bottom
U1  74LVC1G17SE-7  [SOT65P210X110-5N']  28.9,8.2 180 bottom
U$1  [WEEE]  35,21.2 0 bottom
U$2  [ROHS]  4.6,21.2 0 bottom
U$3  [OMV-LOGO]  30.8,22.8 0 bottom
U$9  OPENMV-LOGO  [OPENMV-LOGO]  1.4,22.6 0 top
Z1  14.6,12.2 0 bottom
Z2  28.9,19.9 90 top
Z3  23.1,9.1 0 bottom
Z4  6.2,19.5 90 bottom
Z5  16.6,19.5 90 bottom

### Tracks (layer width: path | path; a pad name or v marks a point on that pad's centre or on a via)
AIN
  Top 0.406: J2.7 25.81,10.4 JP6.2 25.81,19.8 25.8,20.05 R4.2
AIN_INT
  Top 0.406: R4.1 27.2,17.68 27.24,17.66 27.22,17.63 R8.1 28.9,17.65 | 28.9,17.65 Z2.1 28.9,19.6 D5.1 | 28.9,17.65 29.85,17.65 IC3.1
AIN_OUT
  Top 0.254: R5.1 31.6,15.7 IC3.4 IC3.3 28.65,15.85 D6.1
AIN_S  (via drill 0.25)
  Top 0.254: v23.3,13.6 23.3,14.4 24,15.1 JP6.1
  Bottom 0.254: R11.2 20.95,14.3 22.6,14.3 v23.3,13.6
EXT_VIN  (via drill 0.61)
  Top 0.61: v8.8,11 10.35,11 J2.1
  Bottom 0.406: Q1.3 9.2,9.4 D4.2
  Bottom 0.61: v8.8,11 9.2,10.6 D4.2
EXT_VIN_BST
  Bottom 0.406: IC2.1 18.55,3.2 C1.1
EXT_VIN_FB
  Bottom 0.406: R2.1 16.65,2.95 IC2.3 16.4,4.05 R1.2 C2.2
EXT_VIN_G
  Bottom 0.406: Q1.1 13.19,10.6 | 13.19,10.6 13.19,12.2 Z1.2 | R3.1 13.19,10.6
EXT_VIN_INT
  Bottom 0.406: IC2.5 IC2.4 | IC2.4 14.75,6.9 C5.1 13.19,6.95 Q1.2 | Z1.1 16.65,12.2 IC2.4
EXT_VIN_OUT  (via drill 0.41)
  Top 0.406: v22,6 21.6,5.6 v16.7,5.6
  Bottom 0.406: v16.7,5.6 16.45,5.35 R1.1 C2.1 | v22,6 L1.2
  Bottom 0.61: C7.2 C8.2 C6.2 27.2,5.3 D1.2 23.4,5.3 L1.2
EXT_VIN_SW
  Bottom 0.406: IC2.6 18.85,6.6 20.6,6.6 L1.1
  Bottom 0.61: C1.2 20.4,1.65 D3.1 20.6,2.1 L1.1
GND  (via drill 0.25, 0.41, 0.61)
  Top 0.254: IC3.2 28.8,16.5 D6.2
  Top 0.406: J1.9 32.6,1.6 32.6,8.1 31.7,8.1 v31.7,9.7 28.4,13 28.4,14.2 v27.1,15.5 27.1,16.35 R8.2 27.55,16.7 D6.2 | v19.4,7.4 19.3,7.3 12.85,7.3 | C9.1 31.95,20.4 D5.2 30.6,21.1 Z2.2 28.9,21.2 27.15,21.2 26.82,21.53 26.82,22.72 25.75,23.79 19.85,23.79 18.6,22.54 v18.6,20.6 | v6.6,11.3 6.6,11.63 5.97,12.26 5.97,18.37 v8.2,20.6
  Top 0.61: J2.2 12.85,7.3 12.85,5.05 v15,2.9
  Bottom 0.254: IC4.3 24.15,11.2 20.9,11.2 | 20.9,11.2 D7.2 | R11.1 20.9,11.2 | D8.2 27.8,15.3 27.6,15.5 v27.1,15.5
  Bottom 0.406: C4.1 8.6,2 C3.1 8.6,1.4 D2.2 6.3,1.4 6.1,1.6 J1.24 | C4.1 11.3,2 IC1.2 11.3,7.4 12.2,8.3 12.2,9.4 | C4.1 10.4,0.8 15,0.8 | 15,0.8 16.4,0.8 | 16.4,0.8 17.6,0.8 | 17.6,0.8 24.95,0.8 | 24.95,0.8 27.2,0.8 | 27.2,0.8 28.9,0.8 | 28.9,0.8 30.6,0.8 | 30.6,0.8 32,0.8 32,1.6 J1.9 | D3.2 24.95,0.8 | C6.1 27.2,0.8 | C8.1 28.9,0.8 | C7.1 30.6,0.8 | IC2.2 17.6,0.8 | R2.2 16.4,0.8 | R3.2 15.45,9.6 C5.2 14.15,9.4 12.2,9.4 | v15,2.9 15,0.8 | D9.2 27.9,10.1 U1.3 28.73,8.85 29.27,8.32 30.57,8.32 C11.1 31.7,9.45 v31.7,9.7 | D7.2 20.9,9.1 Z3.2 19.4,9.1 v19.4,7.4 | 12.2,9.4 11.6,10 11.6,12.8 11.24,13.16 D4.1 7.34,11.3 v6.6,11.3 | D11.2 18.4,17.75 R15.1 Q3.2 17.95,19.95 v18.6,20.6 | D10.2 8,17.75 R14.1 Q2.2 7.55,19.95 v8.2,20.6 | v27.1,15.5 27.1,14.65 | 27.1,14.65 C10.1 | D8.2 27.15,14.6 27.1,14.65
  other vias: 22.9,2.1 32.2,6.2 25,6.6 6.8,7.1 17.7,23.1 34.9,10.4 34.8,5.4
  pour Bottom (isolate 0.152, rank 2): 0.2,0.2 35.4,0.2 35.4,26.6 0.2,26.6
  pour Top (isolate 0.152, rank 2): 0.1,0.1 35.5,0.1 35.5,26.7 0.1,26.7
P0
  Bottom 0.406: R12.1 8.75,15.3 6.91,15.3 JP1.2
P0_COM
  Top 0.61: K1.3 15.35,13.94 J2.3
P0_CONTROL
  Bottom 0.406: Q2.1 R14.2 8.85,17.25 D10.1 8.8,16.65 R12.2
P0_INT
  Bottom 0.254: J1.1 2.88,18.1 4.7,18.1 5.4,17.4 5.4,16 6.09,15.31 JP1.1
P0_N  (via drill 0.61)
  Top 0.61: J2.4 17.85,13.65 12.4,19.1 v12.4,19.2
  Bottom 0.61: v12.4,19.2 JP8.2
P0_NC
  Bottom 0.61: K1.7 11.59,21.97 JP8.1
P0_NO
  Bottom 0.61: K1.5 13.21,21.97 JP8.3
P0_RELAY
  Bottom 0.406: Q2.3 8.2,21.97 K1.8
  Bottom 0.61: Z4.2 6.97,21.97 K1.8
P1_INT
  Top 0.254: J1.2 2.9,18.14 2.9,22.5 5.6,25.2 JP2.1
P2_INT
  Bottom 0.254: JP3.1 16.49,14.8 8.3,14.8 7.3,13.8 5.8,13.8 5.1,13.1 2.8,13.1 J1.3
P6_ADC  (via drill 0.25)
  Top 0.254: v8.4,7.41 8.79,7.41 10.6,5.6 10.6,3.6 12.9,1.3 23.6,1.3 29.3,7 v31.9,7 | v32.6,12.7 31.65,12.7 R5.2
  Bottom 0.254: JP4.2 7.01,7.99 7.6,7.4 v8.4,7.4 v8.4,7.41 | v31.9,7 32.7,7.8 32.7,12.6 v32.6,12.7
P6_ADC_INT
  Bottom 0.254: J1.7 2.86,5.4 4.8,5.4 6.19,6.79 JP4.1
P10_FSYNC  (via drill 0.25, 0.41)
  Top 0.254: v26.5,13.5 26.5,8.7 27.8,7.4 v28.9,7.4
  Bottom 0.254: D8.1 28.6,15.4 27.9,16.1 26.7,16.1 26.4,15.8 26.4,13.6 v26.5,13.5 26.5,12.5 26,12 24.68,12 24.15,12.53 IC4.4 24.15,13.15 23.8,13.5 23.8,14.65 R7.2
  Bottom 0.406: U1.2 28.5,8.2 28.9,7.8 v28.9,7.4 | D8.1 31.09,14.6 JP5.2
P10_FSYNC_INT
  Bottom 0.406: J1.14 32.01,14.3 JP5.1
P12  (via drill 0.25)
  Top 0.254: JP2.2 8.69,23.71 15.32,23.71 16.34,22.69 16.34,19.76 v16.6,19.5
  Bottom 0.254: v16.6,19.5 15.7,18.6 15.7,16.6 16.3,16 17.1,16 17.31,15.79 17.31,15.3
  Bottom 0.406: R13.1 19.15,15.3 17.31,15.3 JP3.2
P12_COM
  Top 0.61: J2.5 20.35,11.65 19.6,12.4 19.6,18 22,20.4 23.6,20.4 24.2,19.8 24.2,18.29 K2.3
P12_CONTROL
  Bottom 0.406: Q3.1 R15.2 19.25,17.25 D11.1 19.2,16.65 R13.2
P12_N  (via drill 0.61)
  Top 0.61: v22.8,19.2 21.2,17.6 21.2,13.2 22.85,11.55 J2.6
  Bottom 0.61: JP9.2 v22.8,19.2
P12_NC
  Bottom 0.61: K2.7 21.99,21.97 JP9.1
P12_NO
  Bottom 0.61: K2.5 23.61,21.97 JP9.3
P12_RELAY
  Bottom 0.406: K2.8 18.6,21.97 Q3.3
  Bottom 0.61: Z5.2 17.37,21.97 K2.8
SW
  Bottom 0.406: IC1.1 L2.2
SYNC  (via drill 0.25)
  Top 0.254: J2.8 27.8,10.45 v27.8,13.62
  Bottom 0.254: JP7.2 27.8,11.8 v27.8,13.62
SYNC_IN
  Bottom 0.254: JP7.3 26.99,11.6 22.7,11.6 R10.2
SYNC_IN_INT
  Bottom 0.406: D7.1 21.75,10.55 R10.1 22.7,9.1 Z3.1 | Z3.1 24.8,8.35 25.25,7.9 R6.2 | Z3.1 IC4.2
SYNC_OUT
  Bottom 0.406: JP7.1 30.45,11.7 R9.2
SYNC_OUT_INT
  Bottom 0.406: R9.1 30.55,10.1 30,10.1 | 30,10.1 D9.1 | 30,10.1 30,8.95 U1.4
V_BATT  (via drill 0.25, 0.41)
  Top 0.254: IC3.5 31.45,17.15 v30.8,16.5 v30.81,16.5 | v29.4,15.2 30.5,14.1 30.5,12.2 31,11.7 v32,11.7
  Top 0.406: v26.6,6.7 21.9,2 v13.2,2 11.4,3.8 11.4,5.6 7.8,9.2 7.8,11.4 8.6,12.2 8.6,13.2 8.6,15.29 K1.1 10.26,20.15 10.95,20.15 11.68,20.88 13.09,20.88 13.82,20.15 14.14,20.15 K2.1 | IC3.5 31.35,17.15 30.65,17.85 C9.2
  Bottom 0.254: v30.81,16.5 29.51,15.2 v29.4,15.2 | C11.2 32.3,8.75 32.3,11.4 v32,11.7
  Bottom 0.406: IC1.4 12.25,2.05 C4.2 v13.2,2 | C11.2 31.1,7.55 U1.5 29.9,7.1 29.5,6.7 v26.6,6.7 26.55,6.75 R6.1
  Bottom 0.61: Z4.1 7,17 K1.1 | Z5.1 17.4,17 K2.1
VCC  (via drill 0.25)
  Top 0.254: J1.8 2.9,2.9 4.8,2.9 5.4,3.5 v5.4,22.6
  Bottom 0.254: J1.8 2.9,2.9 6.5,2.9 D2.1 | IC4.5 25.45,13.3 R7.1 25.05,14.6 C10.2 25.75,16.05 25.6,16.2 25.6,20.11 26.74,21.25 26.74,22.69 25.72,23.71 6.51,23.71 v5.4,22.6
  Bottom 0.406: L2.1 8.6,4.25 C3.2 7.8,2.2 D2.1
VIN
  Bottom 0.61: D1.1 32.84,5.3 J1.10

### Text on the board
tPlace: P1 | PWR - 6V to 36V | AIN - 0 to 5V or 4-20mA | SYN - 0 to 5V I/O | OpenMV | Relay / Shield / R1 | mA | PWR | GND | P0 / COM | P0 / OC | P12 / COM | P12 / OC | AIN | SYN
bPlace: Relay Shield R1 | https://openmv.io | 4.18.23 | NC | NO | NC | NO | P0 | P12 | FSYNC / P10 | P2 | P0 | I | O | ADC / P6 | VIN | RAW | GND | GND